# EAGLE design MiniClock (EAGLE 6.4)
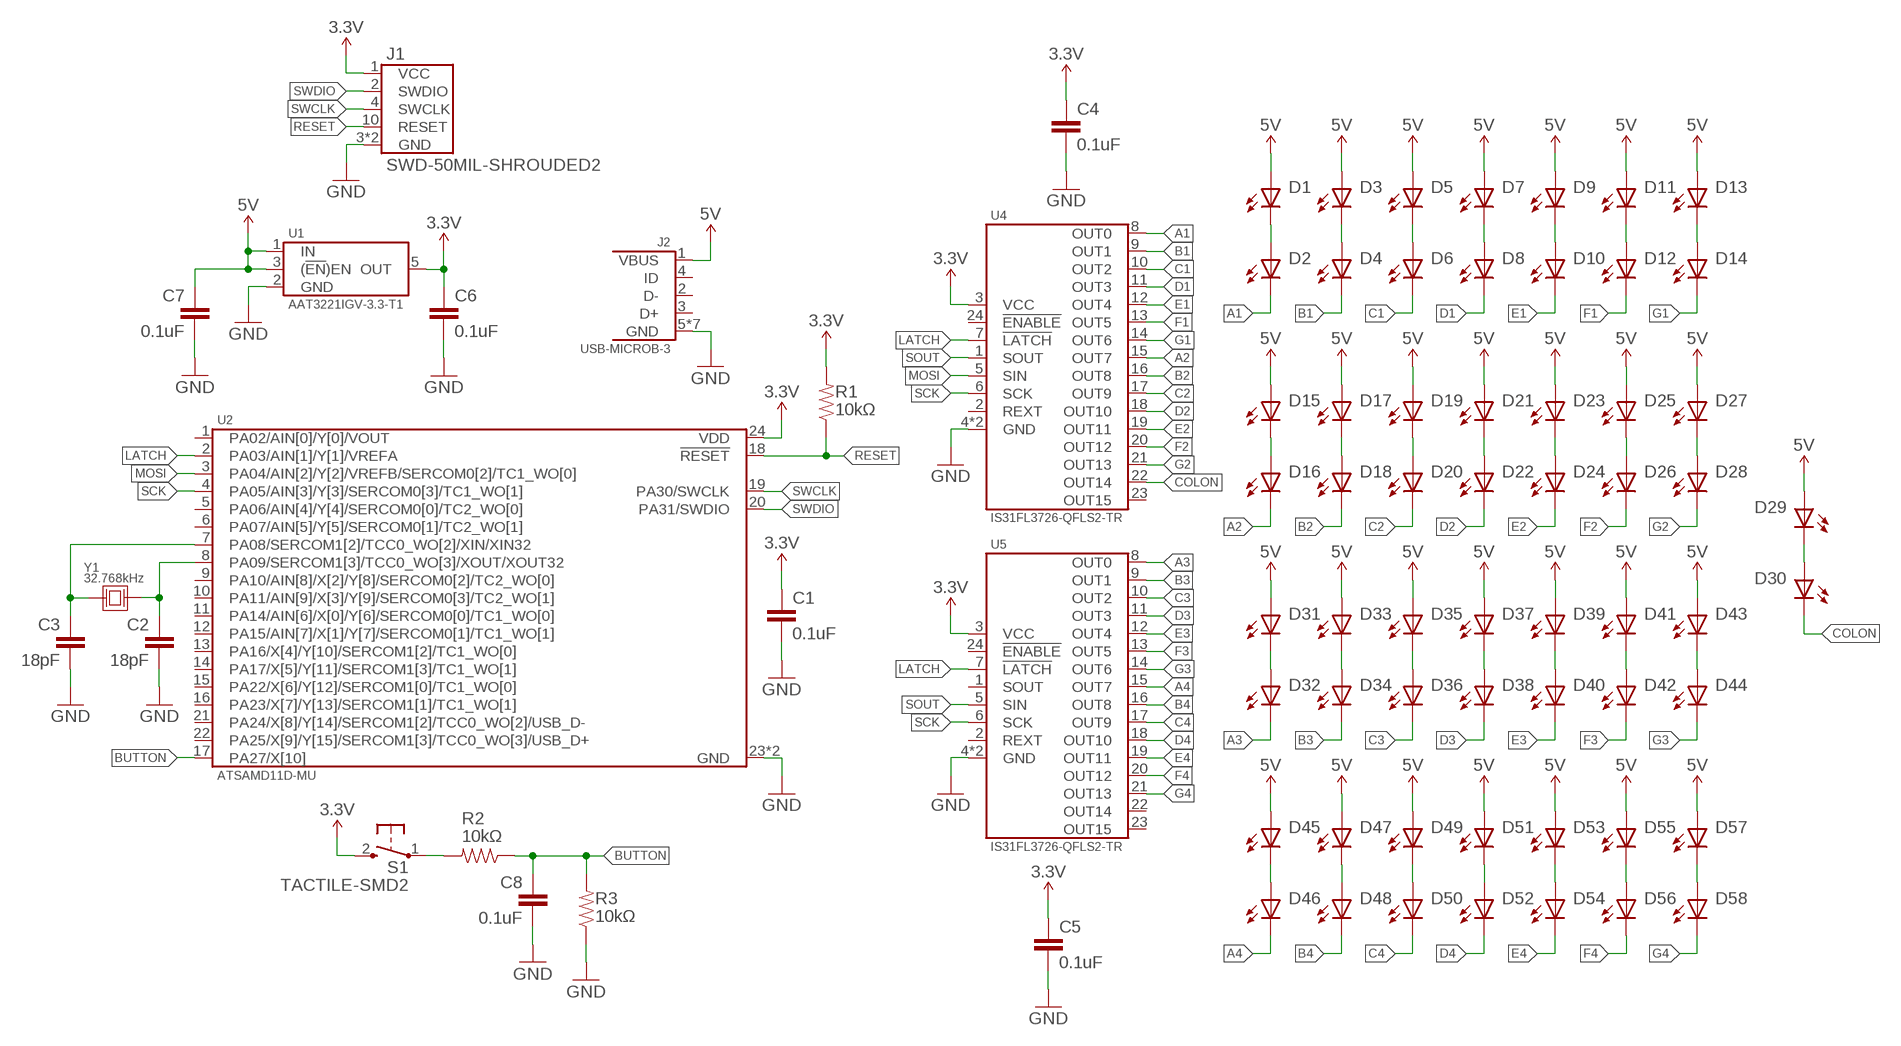
[diagram p0: schematic, sheet 1]

## Parts
C1  0.1uF  CAP-0603  [0603-CAP]
C2  18pF  CAP-0603  [0603-CAP]
C3  18pF  CAP-0603  [0603-CAP]
C4  0.1uF  CAP-0603  [0603-CAP]
C5  0.1uF  CAP-0603  [0603-CAP]
C6  0.1uF  CAP-0603  [0603-CAP]
C7  0.1uF  CAP-0603  [0603-CAP]
C8  0.1uF  CAP-0603  [0603-CAP]
D1  LED-0805  [0805-LED]
D2  LED-0805  [0805-LED]
D3  LED-0805  [0805-LED]
D4  LED-0805  [0805-LED]
D5  LED-0805  [0805-LED]
D6  LED-0805  [0805-LED]
D7  LED-0805  [0805-LED]
D8  LED-0805  [0805-LED]
D9  LED-0805  [0805-LED]
D10  LED-0805  [0805-LED]
D11  LED-0805  [0805-LED]
D12  LED-0805  [0805-LED]
D13  LED-0805  [0805-LED]
D14  LED-0805  [0805-LED]
D15  LED-0805  [0805-LED]
D16  LED-0805  [0805-LED]
D17  LED-0805  [0805-LED]
D18  LED-0805  [0805-LED]
D19  LED-0805  [0805-LED]
D20  LED-0805  [0805-LED]
D21  LED-0805  [0805-LED]
D22  LED-0805  [0805-LED]
D23  LED-0805  [0805-LED]
D24  LED-0805  [0805-LED]
D25  LED-0805  [0805-LED]
D26  LED-0805  [0805-LED]
D27  LED-0805  [0805-LED]
D28  LED-0805  [0805-LED]
D29  LED-0805  [0805-LED]
D30  LED-0805  [0805-LED]
D31  LED-0805  [0805-LED]
D32  LED-0805  [0805-LED]
D33  LED-0805  [0805-LED]
D34  LED-0805  [0805-LED]
D35  LED-0805  [0805-LED]
D36  LED-0805  [0805-LED]
D37  LED-0805  [0805-LED]
D38  LED-0805  [0805-LED]
D39  LED-0805  [0805-LED]
D40  LED-0805  [0805-LED]
D41  LED-0805  [0805-LED]
D42  LED-0805  [0805-LED]
D43  LED-0805  [0805-LED]
D44  LED-0805  [0805-LED]
D45  LED-0805  [0805-LED]
D46  LED-0805  [0805-LED]
D47  LED-0805  [0805-LED]
D48  LED-0805  [0805-LED]
D49  LED-0805  [0805-LED]
D50  LED-0805  [0805-LED]
D51  LED-0805  [0805-LED]
D52  LED-0805  [0805-LED]
D53  LED-0805  [0805-LED]
D54  LED-0805  [0805-LED]
D55  LED-0805  [0805-LED]
D56  LED-0805  [0805-LED]
D57  LED-0805  [0805-LED]
D58  LED-0805  [0805-LED]
J1  SWD-50MIL-SHROUDED2  [M05X2-50MIL-SHROUD]
J2  USB-MICROB-3  [10118192-0001LF]
R1  10kΩ  RESISTOR-0603  [0603-CAP]
R2  10kΩ  RESISTOR-0603  [0603-CAP]
R3  10kΩ  RESISTOR-0603  [0603-CAP]
S1  TACTILE-SMD2  [PTS820-J15M-SMTR-LFS]
U1  AAT3221IGV-3.3-T1  [SOT23-5]
U2  ATSAMD11D-MU  [QFN-24]
U4  IS31FL3726-QFLS2-TR  [QFN-24-4X4]
U5  IS31FL3726-QFLS2-TR  [QFN-24-4X4]
Y1  32.768kHz  CRYSTAL2-SMD  [SC32S]

## Nets
3.3V: C1.1 C4.1 C5.1 C6.1 J1.1(VCC) R1.2 S1.2 U1.5(OUT) U2.24(VDD) U4.3(VCC) U5.3(VCC)
5V: C7.1 D1.A D3.A D5.A D7.A D9.A D11.A D13.A D15.A D17.A D19.A D21.A D23.A D25.A D27.A D29.A D31.A D33.A D35.A D37.A D39.A D41.A D43.A D45.A D47.A D49.A D51.A D53.A D55.A D57.A J2.1(VBUS) U1.1(IN) U1.3((!EN!)EN)
A1: D2.C U4.8(OUT0)
A2: D16.C U4.15(OUT7)
A3: D32.C U5.8(OUT0)
A4: D46.C U5.15(OUT7)
B1: D4.C U4.9(OUT1)
B2: D18.C U4.16(OUT8)
B3: D34.C U5.9(OUT1)
B4: D48.C U5.16(OUT8)
BUTTON: C8.1 R2.1 R3.2 U2.17(PA27/X[10])
C1: D6.C U4.10(OUT2)
C2: D20.C U4.17(OUT9)
C3: D36.C U5.10(OUT2)
C4: D50.C U5.17(OUT9)
COLON: D30.C U4.22(OUT14)
D1: D8.C U4.11(OUT3)
D2: D22.C U4.18(OUT10)
D3: D38.C U5.11(OUT3)
D4: D52.C U5.18(OUT10)
E1: D10.C U4.12(OUT4)
E2: D24.C U4.19(OUT11)
E3: D40.C U5.12(OUT4)
E4: D54.C U5.19(OUT11)
F1: D12.C U4.13(OUT5)
F2: D26.C U4.20(OUT12)
F3: D42.C U5.13(OUT5)
F4: D56.C U5.20(OUT12)
G1: D14.C U4.14(OUT6)
G2: D28.C U4.21(OUT13)
G3: D44.C U5.14(OUT6)
G4: D58.C U5.21(OUT13)
GND: C1.2 C2.2 C3.2 C4.2 C5.2 C6.2 C7.2 C8.2 J1.3(GND) J1.5(GND) J2.5(GND) J2.P$6(GND) J2.P$7(GND) J2.P$8(GND) J2.P$9(GND) J2.P$10(GND) J2.P$11(GND) R3.1 U1.2(GND) U2.23(GND) U2.P$1(GND) U4.4(GND) U4.PAD(GND) U5.4(GND) U5.PAD(GND)
LATCH: U2.2(PA03/AIN[1]/Y[1]/VREFA) U4.7(!LATCH) U5.7(!LATCH)
MOSI: U2.3(PA04/AIN[2]/Y[2]/VREFB/SERCOM0[2]/TC1_WO[0]) U4.5(SIN)
N$1: C2.1 U2.8(PA09/SERCOM1[3]/TCC0_WO[3]/XOUT/XOUT32) Y1.P$2
N$2: C3.1 U2.7(PA08/SERCOM1[2]/TCC0_WO[2]/XIN/XIN32) Y1.P$1
N$3: D1.C D2.A
N$4: D13.C D14.A
N$5: D11.C D12.A
N$6: D9.C D10.A
N$7: D7.C D8.A
N$8: D5.C D6.A
N$9: D3.C D4.A
N$10: D27.C D28.A
N$11: D25.C D26.A
N$12: D23.C D24.A
N$13: D15.C D16.A
N$14: D17.C D18.A
N$15: D19.C D20.A
N$16: D21.C D22.A
N$17: D29.C D30.A
N$18: D31.C D32.A
N$19: D43.C D44.A
N$20: D41.C D42.A
N$21: D39.C D40.A
N$22: D37.C D38.A
N$23: D35.C D36.A
N$24: D33.C D34.A
N$25: D45.C D46.A
N$26: D47.C D48.A
N$27: D49.C D50.A
N$28: D51.C D52.A
N$29: D53.C D54.A
N$30: D55.C D56.A
N$31: D57.C D58.A
N$33: R2.2 S1.1
RESET: J1.10(RESET) R1.1 U2.18(!RESET)
SCK: U2.4(PA05/AIN[3]/Y[3]/SERCOM0[3]/TC1_WO[1]) U4.6(SCK) U5.6(SCK)
SOUT: U4.1(SOUT) U5.5(SIN)
SWCLK: J1.4(SWCLK) U2.19(PA30/SWCLK)
SWDIO: J1.2(SWDIO) U2.20(PA31/SWDIO)
Unconnected: J2.2(D-) J2.3(D+) J2.4(ID) U2.1(PA02/AIN[0]/Y[0]/VOUT) U2.5(PA06/AIN[4]/Y[4]/SERCOM0[0]/TC2_WO[0]) U2.6(PA07/AIN[5]/Y[5]/SERCOM0[1]/TC2_WO[1]) U2.9(PA10/AIN[8]/X[2]/Y[8]/SERCOM0[2]/TC2_WO[0]) U2.10(PA11/AIN[9]/X[3]/Y[9]/SERCOM0[3]/TC2_WO[1]) U2.11(PA14/AIN[6]/X[0]/Y[6]/SERCOM0[0]/TC1_WO[0]) U2.12(PA15/AIN[7]/X[1]/Y[7]/SERCOM0[1]/TC1_WO[1]) U2.13(PA16/X[4]/Y[10]/SERCOM1[2]/TC1_WO[0]) U2.14(PA17/X[5]/Y[11]/SERCOM1[3]/TC1_WO[1]) U2.15(PA22/X[6]/Y[12]/SERCOM1[0]/TC1_WO[0]) U2.16(PA23/X[7]/Y[13]/SERCOM1[1]/TC1_WO[1]) U2.21(PA24/X[8]/Y[14]/SERCOM1[2]/TCC0_WO[2]/USB_D-) U2.22(PA25/X[9]/Y[15]/SERCOM1[3]/TCC0_WO[3]/USB_D+) U4.2(REXT) U4.23(OUT15) U4.24(!ENABLE) U5.1(SOUT) U5.2(REXT) U5.22(OUT14) U5.23(OUT15) U5.24(!ENABLE)

## Library data of the parts
C1-C8 = Passives:CAP
D1-D58 = Passives:LED
J1 = Connectors:SWD
J2 = Connectors:USB-MICROB
R1-R3 = Passives:RESISTOR
S1 = Passives:TACTILE
U1 = Skyworks:AAT3221: 150mA 3.3v LDO Regulator
U2 = Atmel:ATSAMD11D
U4 U5 = ISSI:IS31FL3726
Y1 = Passives:CRYSTAL2

## Board
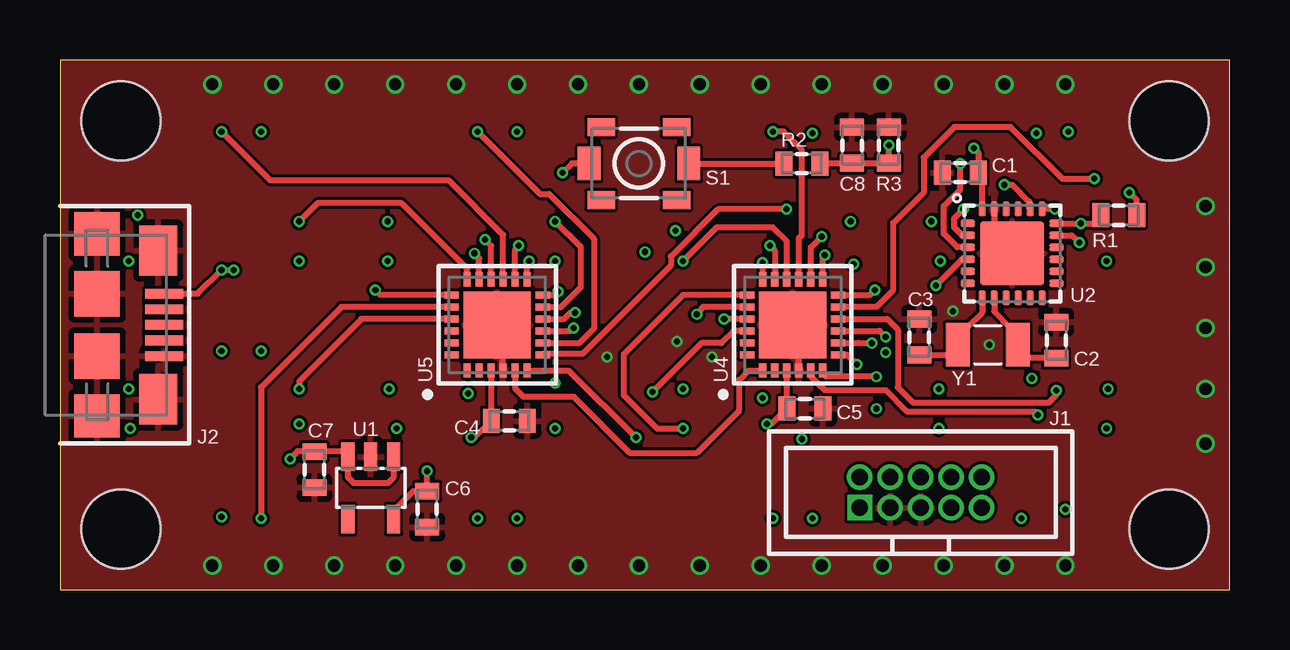
[diagram p1: board, top side]
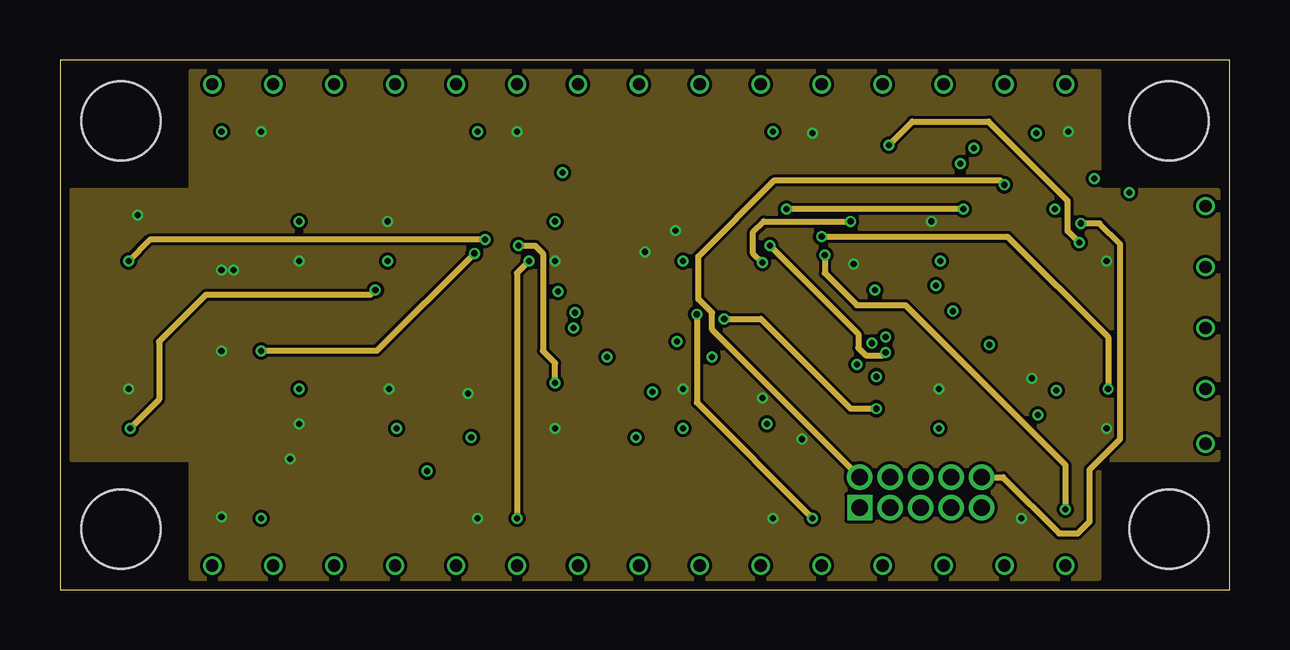
[diagram p2: board, inner layer Route2]
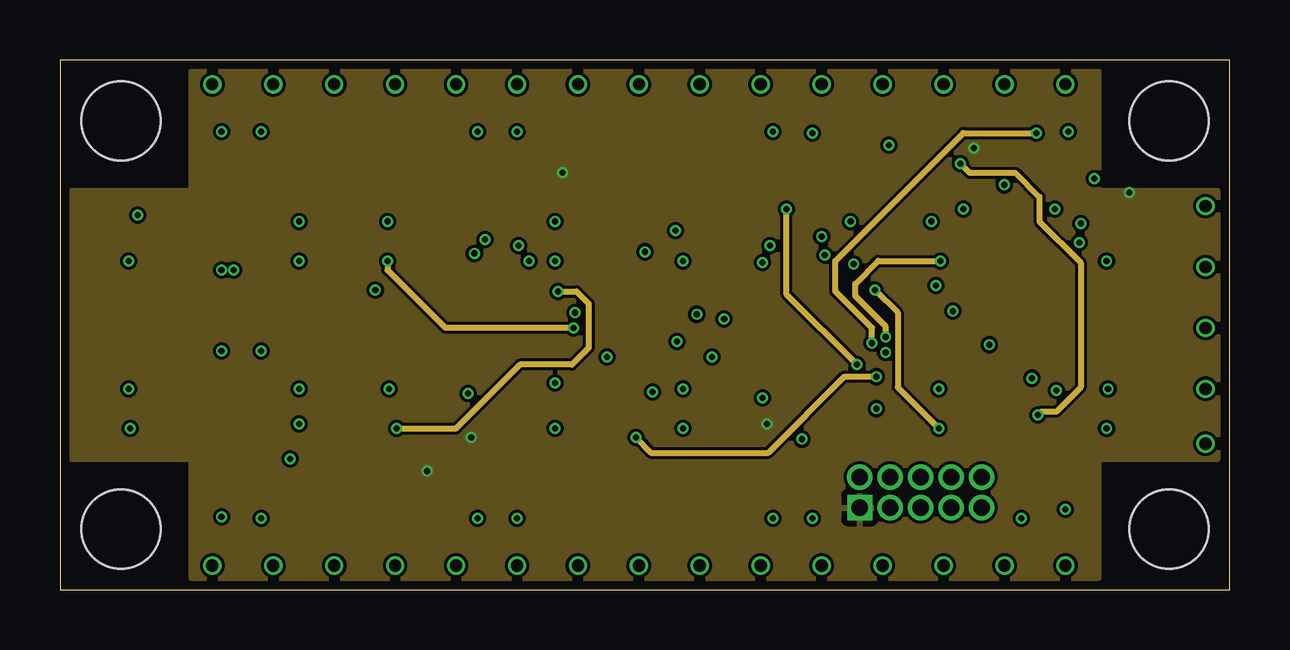
[diagram p3: board, inner layer Route15]
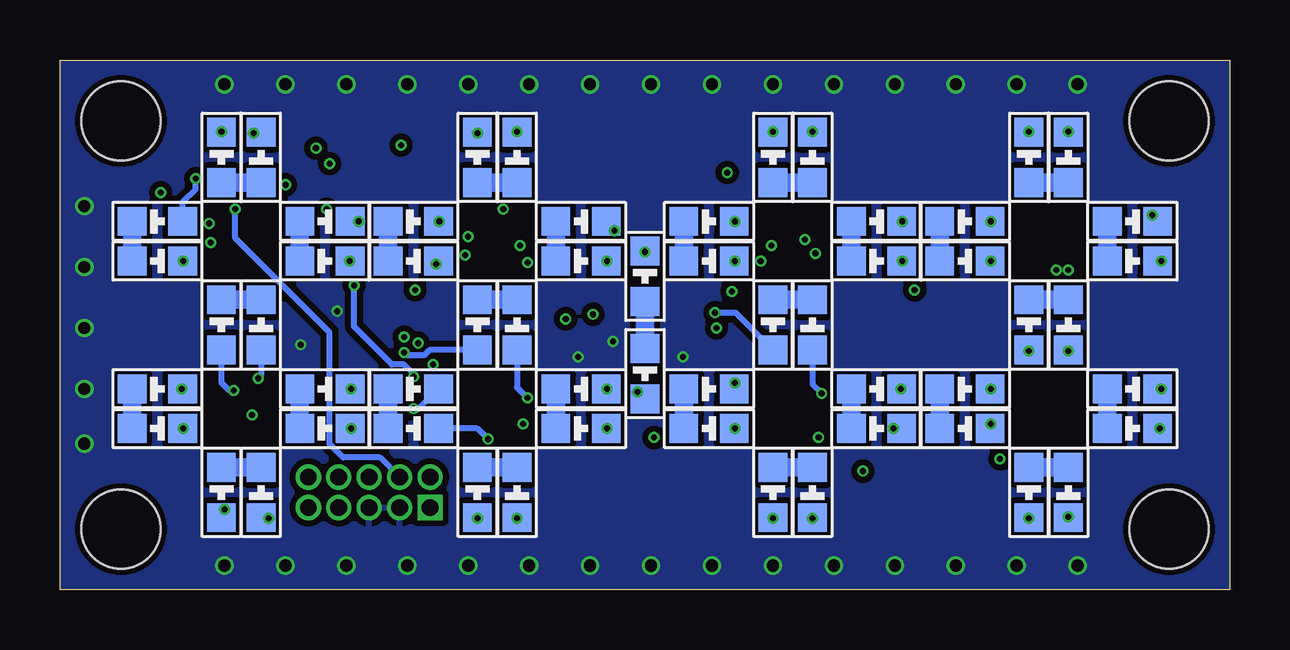
[diagram p4: board, bottom side, seen from below]

Size 48.77 x 22.1 mm. Coordinates in mm from the lower left corner, seen from the top.
Outline: 0,0 48.77,0 48.77,22.1 0,22.1 0,0
Copper layers (1*2*15*16): Top 0.035559375mm / dielectric 0.17018125mm / Route2 0.01778125mm / dielectric 47mil / Route15 0.01778125mm / dielectric 0.17018125mm / Bottom 0.035559375mm
Design rules "OSHPark-4layer *": minimum track width 10mil, minimum drill 10mil, track to track 5mil, track to pad 5mil, pad to pad 5mil, via to via 5mil, smd to smd 5mil, copper to edge 0mil, drill to drill 6mil, minimum pad ring 4mil, minimum via ring 4mil, stop-mask expansion 4mil, vias tented up to drill 20mil, thermal gap 10mil
Holes 3.3 mm at 46.23,19.56 46.23,2.54 2.54,19.56 2.54,2.54

### Footprints (pad centres in the part's own frame; a part is rotated, then mirrored left to right if it is on the bottom)
0603-CAP = smd 0.7 x 1: 1 -0.75,0; 2 0.75,0
0805-LED = smd 1.2 x 1.2: A -1.05,0; C 1.05,0
M05X2-50MIL-SHROUD = drill 0.7 pad 1 square: 1 -2.54,-0.635 | drill 0.7 pad 1: 2 -2.54,0.635; 3 -1.27,-0.635; 4 -1.27,0.635; 5 0,-0.635; 6 0,0.635; 7 1.27,-0.635; 8 1.27,0.635; 9 2.54,-0.635; 10 2.54,0.635
10118192-0001LF = smd 1.6 x 0.4: 1 -0.1,1.3; 2 -0.1,0.65; 3 -0.1,0; 4 -0.1,-0.65; 5 -0.1,-1.3 | smd 1.6 x 2.1: P$6 -0.35,-3.1; P$7 -0.35,3.1 | smd 1.9 x 1.9: P$8 -2.9,1.3; P$9 -2.9,-1.3 | smd 1.9 x 1.8: P$10 -2.9,3.8; P$11 -2.9,-3.8
PTS820-J15M-SMTR-LFS = smd 0.95 x 1.4: 1 -2.075,0; 2 2.075,0 | smd 1.15 x 0.75: P$3 1.575,1.525; P$4 1.575,-1.525; P$5 -1.575,-1.525; P$6 -1.575,1.525
SOT23-5 = smd 1.2 x 0.55: 1 1.3,-0.95; 2 1.3,0; 3 1.3,0.95; 4 -1.3,0.95; 5 -1.3,-0.95
QFN-24 = smd 0.6 x 0.29: 1 -1.85,1.25; 2 -1.85,0.75; 3 -1.85,0.25; 4 -1.85,-0.25; 5 -1.85,-0.75; 6 -1.85,-1.25; 13 1.85,-1.25; 14 1.85,-0.75; 15 1.85,-0.25; 16 1.85,0.25; 17 1.85,0.75; 18 1.85,1.25 | smd 0.29 x 0.6: 7 -1.25,-1.85; 8 -0.75,-1.85; 9 -0.25,-1.85; 10 0.25,-1.85; 11 0.75,-1.85; 12 1.25,-1.85; 19 1.25,1.85; 20 0.75,1.85; 21 0.25,1.85; 22 -0.25,1.85; 23 -0.75,1.85; 24 -1.25,1.85 | smd 2.65 x 2.65: P$1 0,0
QFN-24-4X4 = smd 0.6 x 0.3: 1 -1.9,1.25; 2 -1.9,0.75; 3 -1.9,0.25; 4 -1.9,-0.25; 5 -1.9,-0.75; 6 -1.9,-1.25; 13 1.9,-1.25; 14 1.9,-0.75; 15 1.9,-0.25; 16 1.9,0.25; 17 1.9,0.75; 18 1.9,1.25 | smd 0.3 x 0.6: 7 -1.25,-1.9; 8 -0.75,-1.9; 9 -0.25,-1.9; 10 0.25,-1.9; 11 0.75,-1.9; 12 1.25,-1.9; 19 1.25,1.9; 20 0.75,1.9; 21 0.25,1.9; 22 -0.25,1.9; 23 -0.75,1.9; 24 -1.25,1.9 | smd 2.8 x 2.8: PAD 0,0
SC32S = smd 1 x 1.8: P$1 -1.25,0; P$2 1.25,0

### Placement (x,y rotation side)
C1  37.53,17.4 180 top
C2  41.53,10.41 90 top
C3  35.81,10.54 90 top
C4  18.73,7.05 0 top
C5  31.05,7.56 0 top
C6  15.3,3.37 270 top
C7  10.6,5.02 270 top
C8  33.02,18.54 90 top
D1  42.04,18.03 270 bottom
D2  40.39,18.03 90 bottom
D3  37.72,15.37 180 bottom
D4  37.72,13.72 0 bottom
D5  40.39,11.05 90 bottom
D6  42.04,11.05 270 bottom
D7  44.7,13.72 180 bottom
D8  44.7,15.37 0 bottom
D9  37.72,8.38 180 bottom
D10  37.72,6.73 0 bottom
D11  40.39,4.06 90 bottom
D12  42.04,4.06 270 bottom
D13  44.7,6.73 180 bottom
D14  44.7,8.38 0 bottom
D15  31.37,18.03 270 bottom
D16  29.72,18.03 90 bottom
D17  27.05,15.37 180 bottom
D18  27.05,13.72 0 bottom
D19  29.72,11.05 90 bottom
D20  31.37,11.05 270 bottom
D21  34.04,13.72 180 bottom
D22  34.04,15.37 0 bottom
D23  27.05,8.38 180 bottom
D24  27.05,6.73 0 bottom
D25  29.72,4.06 90 bottom
D26  31.37,4.06 270 bottom
D27  34.04,6.73 180 bottom
D28  34.04,8.38 0 bottom
D29  24.38,13.08 270 bottom
D30  24.38,9.02 270 bottom
D31  19.05,18.03 270 bottom
D32  17.4,18.03 90 bottom
D33  14.73,15.37 180 bottom
D34  14.73,13.72 0 bottom
D35  17.4,11.05 90 bottom
D36  19.05,11.05 270 bottom
D37  21.72,13.72 180 bottom
D38  21.72,15.37 0 bottom
D39  14.73,8.38 180 bottom
D40  14.73,6.73 0 bottom
D41  17.4,4.06 90 bottom
D42  19.05,4.06 270 bottom
D43  21.72,6.73 180 bottom
D44  21.72,8.38 0 bottom
D45  8.38,18.03 270 bottom
D46  6.73,18.03 90 bottom
D47  4.06,15.37 180 bottom
D48  4.06,13.72 0 bottom
D49  6.73,11.05 90 bottom
D50  8.38,11.05 270 bottom
D51  11.05,13.72 180 bottom
D52  11.05,15.37 0 bottom
D53  4.06,8.38 180 bottom
D54  4.06,6.73 0 bottom
D55  6.73,4.06 90 bottom
D56  8.38,4.06 270 bottom
D57  11.05,6.73 180 bottom
D58  11.05,8.38 0 bottom
J1  35.88,4.06 0 top
J2  4.45,11.05 0 top
R1  44.13,15.62 0 top
R2  30.92,17.78 180 top
R3  34.54,18.54 270 top
S1  24.13,17.78 180 top
U1  12.95,4.25 90 top
U2  39.69,14.03 0 top
U4  30.54,11.05 90 top
U5  18.22,11.05 90 top
Y1  38.67,10.22 0 top

### Tracks (layer width: path | path; a pad name or v marks a point on that pad's centre or on a via)
3.3V  (via drill 0.25)
  Top 0.254: U2.24 38.44,17.24 C1.1 38.28,18.24 v38.1,18.41 | R1.2 44.88,16.27 v44.58,16.57 | U4.3 C5.1 29.67,6.92 v29.46,6.92 | U5.3 C4.1 17.28,6.35 v17.14,6.35 | U1.5 13.9,3.3 14.72,4.12 C6.1 v15.3,4.95 | S1.2 21.34,17.78 v20.95,17.4
  pour Route15 (rank 2): 43.31,21.59 5.46,21.59 5.46,16.64 0.51,16.64 0.51,5.46 5.46,5.46 5.46,0.51 43.31,0.51 43.31,5.46 48.26,5.46 48.26,16.64 43.31,16.64
5V  (via drill 0.25)
  Top 0.254: v9.59,5.46 9.91,5.78 10.41,5.78 10.53,5.77 C7.1 11.98,5.77 U1.3 12,4.7 12.26,4.45 13.65,4.45 13.9,4.7 U1.1 | J2.1 5.75,12.35 v6.73,13.34 v7.24,13.34
  Bottom 0.254: D45.A v8.38,19.11 | D47.A v3.24,15.62 | D51.A v9.97,13.72 | D49.A v6.73,9.97 | D53.A v2.86,8.38 | D57.A v9.97,6.92 | D39.A v13.72,8.38 | D55.A v6.73,3.05 | v17.4,2.98 D41.A | D43.A v20.64,6.73 | v25.97,8.38 D23.A | v29.72,2.98 D25.A | v30.92,6.29 31.37,6.73 D27.A | D9.A v36.64,8.38 | v43.62,6.73 D13.A | v40.07,2.98 D11.A | D7.A v43.62,13.72 | D3.A v36.32,15.37 | D21.A v33.08,13.59 | v42.04,19.11 D1.A | v31.37,19.05 D15.A | v25.65,14.99 D17.A | D29.A v24.38,14.1 | D37.A v20.64,13.72 | D31.A v19.05,19.11 | D33.A v13.65,15.37 | D5.A 40.39,8.95 v40.51,8.83 | D35.A 17.4,8.57 v17.02,8.19 | D19.A 29.72,8.45 v29.27,8
  pour Route2 (rank 2): 48.26,16.64 43.31,16.64 43.31,21.59 5.46,21.59 5.46,16.64 0.51,16.64 0.51,5.46 5.46,5.46 5.46,0.51 43.31,0.51 43.31,5.46 48.26,5.46
A1  (via drill 0.25)
  Top 0.254: U4.8 33.26,10.3 v33.85,10.29
  Route15 0.254: v33.85,10.29 33.85,10.92 32.32,12.45 32.32,13.72 37.66,19.05 v40.7,19.05
  Bottom 0.254: D2.C v40.7,19.05
A2  (via drill 0.25)
  Top 0.254: U4.15 30.79,14.66 30.92,14.8 30.92,18.04 30.92,18.35 30.16,19.11 v29.72,19.11
  Bottom 0.254: D16.C v29.72,19.11
A3  (via drill 0.25)
  Top 0.254: U5.8 21.65,10.3 22.25,10.9 22.25,14.64 20.38,16.51 20,16.51 v17.4,19.11
  Bottom 0.254: v17.4,19.11 D32.C
A4  (via drill 0.25)
  Top 0.254: v6.73,19.11 8.76,17.08 16.19,17.08 18.47,14.8 U5.15
  Bottom 0.254: D46.C v6.73,19.11
B1  (via drill 0.25)
  Top 0.254: U4.9 34.16,10.8 v34.42,10.54
  Route15 0.254: v34.42,10.54 34.42,10.99 33.15,12.26 33.15,12.76 34.1,13.72 v36.7,13.72
  Bottom 0.254: D4.C v36.7,13.72
B2  (via drill 0.25)
  Top 0.254: U4.16 30.29,14.54 29.72,15.11 27.37,15.11 v25.97,13.72
  Bottom 0.254: D18.C v25.97,13.72
B3  (via drill 0.25)
  Top 0.254: U5.9 21.28,10.8 v21.4,10.92
  Route15 0.254: v21.4,10.92 16.07,10.92 13.65,13.34 v13.65,13.72
  Bottom 0.254: D34.C v13.65,13.72
B4  (via drill 0.25)
  Top 0.254: U5.16 17.97,14.35 v17.72,14.61
  Route2 0.254: v17.72,14.61 3.75,14.61 v2.86,13.72
  Bottom 0.254: D48.C v2.86,13.72
BUTTON  (via drill 0.25)
  Top 0.254: R2.1 31.69,17.79 C8.1 R3.2 v34.54,18.54 | U2.17 42.18,14.78 v42.48,14.48
  Route2 0.254: v42.48,14.48 42.01,14.95 42.01,16.22 38.7,19.53 35.53,19.53 v34.54,18.54
C1  (via drill 0.25)
  Top 0.254: U4.10 34.48,11.3 34.92,10.85 34.92,8.45 35.56,7.81 41.21,7.81 41.53,8.13 v41.53,8.32
  Bottom 0.254: D6.C 42.04,8.64 41.72,8.32 v41.53,8.32
C2  (via drill 0.25)
  Top 0.254: v29.59,14.35 29.79,14.15 U4.17
  Route2 0.254: v29.59,14.35 33.27,10.67 33.27,10.1 33.59,9.78 34.29,9.78 v34.42,9.91
  Bottom 0.254: D20.C 33.37,10 33.59,9.78 34.29,9.78 v34.42,9.91
C3  (via drill 0.25)
  Top 0.254: U5.10 21.02,11.3 21.27,11.56 v21.46,11.56
  Bottom 0.254: v21.46,11.56 20.61,11.56 D36.C
C4  (via drill 0.25)
  Top 0.254: U5.17 17.47,13.83 v17.27,14.03
  Route2 0.254: v17.27,14.03 13.21,9.97 v8.38,9.97
  Bottom 0.254: D50.C v8.38,9.97
COLON  (via drill 0.25)
  Top 0.254: U4.22 28.07,10.8 27.56,10.29 26.73,10.29 v24.7,8.26
  Bottom 0.254: D30.C v24.7,8.26
D1  (via drill 0.25)
  Top 0.254: U4.11 34.04,11.8 34.73,12.5 34.73,15.3 36.01,16.57 36.01,18.03 37.27,19.3 39.62,19.3 41.78,17.14 v43.12,17.14
  Bottom 0.254: D8.C 43.65,16.16 43.12,16.7 v43.12,17.14
D2  (via drill 0.25)
  Top 0.254: U4.18 29.29,13.63 v29.27,13.65
  Route2 0.254: v29.27,13.65 28.89,14.03 28.89,14.92 29.34,15.37 v32.96,15.37
  Bottom 0.254: v32.96,15.37 D22.C
D3  (via drill 0.25)
  Top 0.254: U5.11 20.89,11.8 21.72,12.62 21.72,14.29 v20.64,15.37
  Bottom 0.254: D38.C v20.64,15.37
D4  (via drill 0.25)
  Top 0.254: U5.18 16.97,13.4 14.24,16.13 10.73,16.13 v9.97,15.37
  Bottom 0.254: D52.C v9.97,15.37
E1  (via drill 0.25)
  Top 0.254: U4.12 33.76,12.3 v33.97,12.51
  Route15 0.254: v33.97,12.51 34.92,11.56 34.92,8.45 v36.64,6.73
  Bottom 0.254: v36.64,6.73 D10.C
E2  (via drill 0.25)
  Top 0.254: U4.19 25.97,12.3 23.5,9.82 23.5,8.13 24.89,6.73 v25.97,6.73
  Bottom 0.254: D24.C v25.97,6.73
E3  (via drill 0.25)
  Top 0.254: U5.12 20.62,12.3 v20.77,12.45
  Route15 0.254: v20.77,12.45 21.53,12.45 22.04,11.94 22.04,10.1 21.34,9.4 19.18,9.4 16.51,6.73 v14.03,6.73
  Bottom 0.254: D40.C v14.03,6.73
E4  (via drill 0.25)
  Top 0.254: U5.19 13.36,12.3 v13.14,12.51
  Route2 0.254: v13.14,12.51 12.93,12.3 6.08,12.3 4.13,10.35 4.13,7.94 v2.92,6.73
  Bottom 0.254: D54.C v2.92,6.73
F1  (via drill 0.25)
  Top 0.254: U4.13 31.79,13.89 v31.88,13.97
  Route2 0.254: v31.88,13.97 31.88,13.21 33.21,11.87 35.24,11.87 41.91,5.21 v41.91,3.37
  Bottom 0.254: D12.C v41.91,3.37
F2  (via drill 0.25)
  Top 0.254: U4.20 26.81,11.8 v26.54,11.49
  Route2 0.254: v26.54,11.49 26.54,7.81 v31.37,2.98
  Bottom 0.254: D26.C v31.37,2.98
F3  (via drill 0.25)
  Top 0.254: U5.13 19.47,13.63 v19.56,13.72
  Route2 0.254: v19.56,13.72 19.05,13.21 v19.05,2.98
  Bottom 0.254: D42.C v19.05,2.98
F4  (via drill 0.25)
  Top 0.254: U5.20 11.74,11.8 8.38,8.45 v8.38,2.98
  Bottom 0.254: D56.C v8.38,2.98
G1  (via drill 0.25)
  Top 0.254: U4.14 31.29,14.28 v31.75,14.73
  Route2 0.254: v31.75,14.73 39.5,14.73 43.69,10.54 v43.69,8.38
  Bottom 0.254: D14.C v43.69,8.38
G2  (via drill 0.25)
  Top 0.254: U4.21 v27.69,11.3
  Route2 0.254: v27.69,11.3 29.21,11.3 30.29,10.22 32.96,7.56 v34.04,7.56
  Bottom 0.254: D28.C 33.81,7.56 v34.04,7.56
G3  (via drill 0.25)
  Top 0.254: U5.14 18.97,14.17 v19.11,14.35
  Route2 0.254: v19.11,14.35 19.81,14.35 20.13,14.03 20.13,9.97 20.64,9.46 v20.64,8.64
  Bottom 0.254: D44.C v20.64,8.64
G4  (via drill 0.25)
  Top 0.254: U5.21 12.57,11.3 9.97,8.7 v9.97,8.38
  Bottom 0.254: D58.C v9.97,8.38
GND  (via drill 0.25, 0.51)
  Top 0.254: U5.4 18.47,10.8 U5.PAD | U4.4 30.79,10.8 U4.PAD | U2.23 38.94,14.78 U2.P$1
  other vias: 6.35,1.02 8.89,1.02 11.43,1.02 13.97,1.02 16.51,1.02 19.05,1.02 21.59,1.02 24.13,1.02 26.67,1.02 29.21,1.02 31.75,1.02 34.29,1.02 36.83,1.02 39.37,1.02 41.91,1.02 47.75,6.1 47.75,8.38 47.75,10.92 47.75,13.46 47.75,16 6.35,21.08 8.89,21.08 11.43,21.08 13.97,21.08 16.51,21.08 19.05,21.08 24.13,21.08 21.59,21.08 26.67,21.08 29.21,21.08 31.75,21.08 34.29,21.08 36.83,21.08 39.37,21.08 41.91,21.08 22.8,9.72 25.72,10.35 27.18,9.72 38.73,10.22 37.21,11.62
  pour Bottom (isolate 0.254, rank 2): 48.64,21.97 0.13,21.97 0.13,0.13 48.64,0.13
  pour Top (rank 2): 48.64,21.97 0.13,21.97 0.13,0.13 48.64,0.13
LATCH  (via drill 0.25)
  Top 0.254: v30.29,15.88 27.43,15.88 25.46,13.91 25.46,13.53 21.78,9.84 20.13,9.84 U5.7 | v37.66,15.88 37.27,15.49 37.27,15.11 37.59,14.8 37.78,14.8 U2.2 | U4.7 32.81,9.8 v33.21,9.4
  Route2 0.254: v37.66,15.88 v30.29,15.88
  Route15 0.254: v33.21,9.4 30.29,12.32 v30.29,15.88
MOSI  (via drill 0.25)
  Top 0.254: v40.77,7.3 40.64,7.43 35.31,7.43 34.42,8.32 31.88,8.32 31.3,8.89 31.3,9.14 U4.5 | v37.53,17.78 37.53,16.7 36.84,16.01 36.84,14.85 37.4,14.29 37.78,14.29 U2.3
  Route15 0.254: v40.77,7.3 40.89,7.43 41.53,7.43 42.55,8.45 42.55,13.65 40.83,15.37 40.83,16.38 39.81,17.4 37.91,17.4 v37.53,17.78
N$1
  Top 0.254: U2.8 38.94,11.61 39.62,10.92 39.62,10.52 Y1.P$2 40.13,10.01 40.13,9.72 40.18,9.66 C2.1
N$2
  Top 0.254: U2.7 38.44,11.58 37.78,10.92 37.78,10.59 Y1.P$1 36.99,9.79 C3.1
N$3
  Bottom 0.762: D2.A D1.C
N$4
  Bottom 0.762: D13.C D14.A
N$5
  Bottom 0.762: D11.C D12.A
N$6
  Bottom 0.762: D10.A D9.C
N$7
  Bottom 0.762: D7.C D8.A
N$8
  Bottom 0.762: D6.A D5.C
N$9
  Bottom 0.762: D4.A D3.C
N$10
  Bottom 0.762: D27.C D28.A
N$11
  Bottom 0.762: D25.C D26.A
N$12
  Bottom 0.762: D24.A D23.C
N$13
  Bottom 0.762: D15.C D16.A
N$14
  Bottom 0.762: D17.C D18.A
N$15
  Bottom 0.762: D20.A D19.C
N$16
  Bottom 0.762: D21.C D22.A
N$17
  Bottom 0.762: D29.C D30.A
N$18
  Bottom 0.762: D31.C D32.A
N$19
  Bottom 0.762: D44.A D43.C
N$20
  Bottom 0.762: D42.A D41.C
N$21
  Bottom 0.762: D40.A D39.C
N$22
  Bottom 0.762: D37.C D38.A
N$23
  Bottom 0.762: D36.A D35.C
N$24
  Bottom 0.762: D33.C D34.A
N$25
  Bottom 0.762: D46.A D45.C
N$26
  Bottom 0.762: D47.C D48.A
N$27
  Bottom 0.762: D50.A D49.C
N$28
  Bottom 0.762: D52.A D51.C
N$29
  Bottom 0.762: D54.A D53.C
N$30
  Bottom 0.762: D56.A D55.C
N$31
  Bottom 0.762: D57.C D58.A
N$33
  Top 0.254: S1.1 R2.2
RESET  (via drill 0.25)
  Top 0.254: U2.18 v42.55,15.28 43.26,15.28 R1.1
  Route2 0.254: J1.10 39.31,4.7 41.66,2.35 42.42,2.35 42.93,2.86 42.93,5.02 44.2,6.29 44.2,14.41 43.33,15.28 v42.55,15.28
SCK  (via drill 0.25)
  Top 0.254: U5.6 21.2,9.15 v24,6.35 | 31.79,9.02 31.79,9.04 | v36.51,12.7 37.59,13.78 37.78,13.78 U2.4 | v34.04,8.89 31.94,8.89 31.79,9.04 | 31.79,9.04 U4.6
  Route15 0.254: v24,6.35 24.64,5.71 29.53,5.71 32.7,8.89 v34.04,8.89
  Bottom 0.254: v36.51,12.7 36.51,10.99 34.92,9.4 34.42,9.4 34.04,9.02 v34.04,8.89
SOUT
  Top 0.254: U5.5 18.97,8.39 19.3,8.06 21.4,8.06 23.75,5.71 26.54,5.71 28.32,7.49 28.32,8.76 28.71,9.15 U4.1
SWCLK  (via drill 0.25)
  Top 0.254: v41.47,15.88 40.96,15.88 U2.19
  Bottom 0.254: v41.47,15.88 41.47,14.67 37.53,10.73 37.53,6.1 36.96,5.52 35.43,5.52 J1.4
SWDIO  (via drill 0.25)
  Top 0.254: v39.37,16.89 39.69,16.89 40.39,16.19 40.39,15.94 U2.20
  Route2 0.254: v39.37,16.89 39.18,17.08 29.78,17.08 26.61,13.91 26.61,12.13 27.18,11.56 27.18,10.86 J1.2